# Altium schematic sheet POWER_OSC_BOOT.SchDoc
size A4; DrawnBy: Copyright © 2023 by; Engineer: Artyom Kislevitz Lee; Revision: A
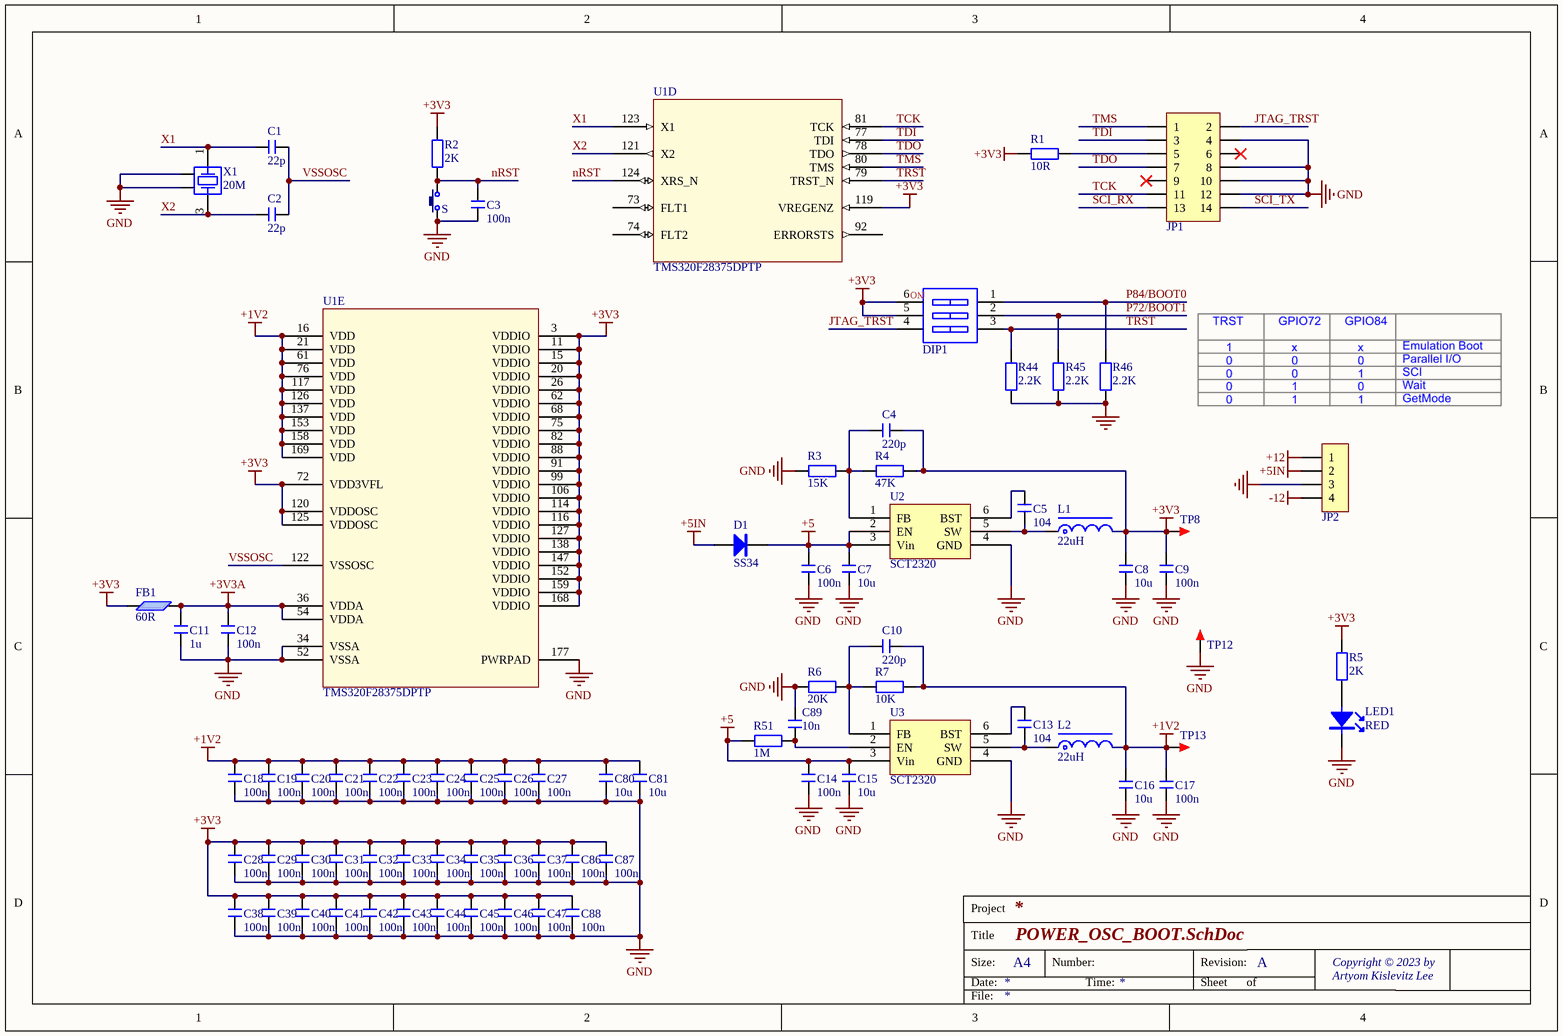
[diagram p0: POWER_OSC_BOOT.SchDoc]

## Parts
C1  22p  [C 0805_L]
C2  22p  [C 0805_L]
C3  100n  [C 0805_L]
C4  220p  [C 0805_L]
C5  104  [C 0805_L]
C6  100n  [C 0805_L]
C7  10u  [C 1210_L]
C8  10u  [C 1210_L]
C9  100n  [C 0805_L]
C10  220p  [C 0805_L]
C11  1u  [C 0805_L]
C12  100n  [C 0805_L]
C13  104  [C 0805_L]
C14  100n  [C 0805_L]
C15  10u  [C 1210_L]
C16  10u  [C 1210_L]
C17  100n  [C 0805_L]
C18  100n  [C 0603_L]
C19  100n  [C 0603_L]
C20  100n  [C 0603_L]
C21  100n  [C 0603_L]
C22  100n  [C 0603_L]
C23  100n  [C 0603_L]
C24  100n  [C 0603_L]
C25  100n  [C 0603_L]
C26  100n  [C 0603_L]
C27  100n  [C 0603_L]
C28  100n  [C 0603_L]
C29  100n  [C 0603_L]
C30  100n  [C 0603_L]
C31  100n  [C 0603_L]
C32  100n  [C 0603_L]
C33  100n  [C 0603_L]
C34  100n  [C 0603_L]
C35  100n  [C 0603_L]
C36  100n  [C 0603_L]
C37  100n  [C 0603_L]
C38  100n  [C 0603_L]
C39  100n  [C 0603_L]
C40  100n  [C 0603_L]
C41  100n  [C 0603_L]
C42  100n  [C 0603_L]
C43  100n  [C 0603_L]
C44  100n  [C 0603_L]
C45  100n  [C 0603_L]
C46  100n  [C 0603_L]
C47  100n  [C 0603_L]
C80  10u  [C 0805_L]
C81  10u  [C 0805_L]
C86  100n  [C 0603_L]
C87  100n  [C 0603_L]
C88  100n  [C 0603_L]
C89  10n  [C 0805_L]
D1  SS34  [SMA]
DIP1  SW-3P  [CSW1.27 SMD-3P]  (value not drawn)
FB1  60R  [R 0805_L]
JP1  Header 2X7  [IDC2.54-LI-2x7P]  (value not drawn)
JP2  HDR-1X4  [KF2510-LI-4P]  (value not drawn)
L1  22uH  [CDRH74]
L2  22uH  [CDRH74]
LED1  RED  [LED 0805R]
R1  10R  [R 0805_L]
R2  2K  [R 0805_L]
R3  15K  [R 0805_L]
R4  47K  [R 0805_L]
R5  2K  [R 0805_L]
R6  20K  [R 0805_L]
R7  10K  [R 0805_L]
R44  2.2K  [R 0805_L]
R45  2.2K  [R 0805_L]
R46  2.2K  [R 0805_L]
R51  1M  [R 0805_L]
S  3x6x5  [TSW DIP-3*6*4.3]  (value not drawn)
TP8  TEST  [TEST 1.6]  (value not drawn)
TP12  TEST  [TEST 1.6]  (value not drawn)
TP13  TEST  [TEST 1.6]  (value not drawn)
U1  TMS320F28375DPTP  [LQFP176-E 24x24_N]  (parts D,E of 5)
U2  SCT2320  [SOT23-6]
U3  SCT2320  [SOT23-6]
X1  20M  [OSC 3225-4P]

## Nets
+1V2: C10.2 C16.2 C17.2 C18.2 C19.2 C20.2 C21.2 C22.2 C23.2 C24.2 C25.2 C26.2 C27.2 C80.2 C81.2 L2.2 R7.2 TP13.1 U1.16(VDD) U1.21(VDD) U1.61(VDD) U1.76(VDD) U1.117(VDD) U1.126(VDD) U1.137(VDD) U1.153(VDD) U1.158(VDD) U1.169(VDD)
+3V3: C4.2 C8.2 C9.2 C28.2 C29.2 C30.2 C31.2 C32.2 C33.2 C34.2 C35.2 C36.2 C37.2 C38.2 C39.2 C40.2 C41.2 C42.2 C43.2 C44.2 C45.2 C46.2 C47.2 C86.2 C87.2 C88.2 DIP1.5 DIP1.6 FB1.1 L1.2 R1.2 R2.2 R4.2 R5.2 TP8.1 U1.3(VDDIO) U1.11(VDDIO) U1.15(VDDIO) U1.20(VDDIO) U1.26(VDDIO) U1.62(VDDIO) U1.68(VDDIO) U1.72(VDD3VFL) U1.75(VDDIO) U1.82(VDDIO) U1.88(VDDIO) U1.91(VDDIO) U1.99(VDDIO) U1.106(VDDIO) U1.114(VDDIO) U1.116(VDDIO) U1.119(VREGENZ) U1.120(VDDOSC) U1.125(VDDOSC) U1.127(VDDIO) U1.138(VDDIO) U1.147(VDDIO) U1.152(VDDIO) U1.159(VDDIO) U1.168(VDDIO)
+3V3A: C11.2 C12.2 FB1.2 U1.36(VDDA) U1.54(VDDA)
+5: C6.2 C7.2 C14.2 C15.2 D1.2(K) R51.1 U2.2(EN) U2.3(Vin) U3.3(Vin)
+5IN: D1.1(A) JP2.2
+12: JP2.1
-12: JP2.4
GND: C3.1 C6.1 C7.1 C8.1 C9.1 C11.1 C12.1 C14.1 C15.1 C16.1 C17.1 C18.1 C19.1 C20.1 C21.1 C22.1 C23.1 C24.1 C25.1 C26.1 C27.1 C28.1 C29.1 C30.1 C31.1 C32.1 C33.1 C34.1 C35.1 C36.1 C37.1 C38.1 C39.1 C40.1 C41.1 C42.1 C43.1 C44.1 C45.1 C46.1 C47.1 C80.1 C81.1 C86.1 C87.1 C88.1 C89.2 JP1.4 JP1.8 JP1.10 JP1.12 JP2.3 LED1.2(K) R3.1 R6.1 R44.2 R45.2 R46.2 S.1 TP12.1 U1.34(VSSA) U1.52(VSSA) U1.177(PWRPAD) U2.4(GND) U3.4(GND) X1.2 X1.4
JTAG_TRST: DIP1.4 JP1.2
nRST: C3.2 R2.1 S.2 U1.124(XRS_N)
P72/BOOT1: DIP1.2 R45.1
P84/BOOT0: DIP1.1 R46.1
SCI_RX: JP1.13
SCI_TX: JP1.14
TCK: JP1.11 U1.81(TCK)
TDI: JP1.3 U1.77(TDI)
TDO: JP1.7 U1.78(TDO)
TMS: JP1.1 U1.80(TMS)
TRST: DIP1.3 R44.1 U1.79(TRST_N)
VSSOSC: C1.1 C2.1 U1.122(VSSOSC)
X1: C1.2 U1.123(X1) X1.1
X2: C2.2 U1.121(X2) X1.3
NetC4_1: C4.1 R3.2 R4.1 U2.1(FB)
NetC5_1: C5.1 U2.6(BST)
NetC5_2: C5.2 L1.1 U2.5(SW)
NetC10_1: C10.1 R6.2 R7.1 U3.1(FB)
NetC13_1: C13.1 U3.6(BST)
NetC13_2: C13.2 L2.1 U3.5(SW)
NetC89_1: C89.1 R51.2 U3.2(EN)
NetJP1_5: JP1.5 R1.1
NetLED1_1: LED1.1(A) R5.1

Not connected (* = marked no-connect by the designer): JP1 6* 9*; U1 73(FLT1) 74(FLT2) 92(ERRORSTS)

## Notes on the sheet
- Project
- Title
- Size:
- Date:
- A4
- Number:
- Time:
- Revision:
- Sheet
- of
- Copyright © 2023 by
- Artyom Kislevitz Lee
- File:
- (in symbol SW-3P) NO

## Library data of the parts
C1-C47 C80 C81 C86-C89 = C: 贴片电容; 淘宝ID: 小糖豆的小窝窝; BOM名称: 贴片电容; 下单链接: https://item.taobao.com/item.htm?ft=t&id=613637044352
D1 = 1N4007: 整流二极管; 淘宝ID: 小糖豆的小窝窝; BOM名称: 整流二极管; 下单链接: https://item.taobao.com/item.htm?ft=t&id=613637044352
DIP1 = SW-3P: 3路编码开关; 淘宝ID: 小糖豆的小窝窝; BOM名称: 3路编码开关; 下单链接: https://item.taobao.com/item.htm?ft=t&id=613637044352
FB1 = FB: 磁珠; BOM名称: 贴片磁珠
JP1 = Header 7X2: 7*2P接插件; 淘宝ID: 小糖豆的小窝窝; BOM名称: 7*2P接插件; 下单链接: https://item.taobao.com/item.htm?ft=t&id=613637044352
JP2 = Header 4: 4P接插件; 淘宝ID: 小糖豆的小窝窝; BOM名称: 4P接插件; 下单链接: https://item.taobao.com/item.htm?ft=t&id=613637044352
L1 L2 = L-CDRH: 功率屏蔽电感; 淘宝ID: 小糖豆的小窝窝; BOM名称: 功率屏蔽电感; 下单链接: https://item.taobao.com/item.htm?ft=t&id=613637044352
LED1 = LED-SMD: 贴片LED; 淘宝ID: 小糖豆的小窝窝; BOM名称: 贴片LED; 下单链接: https://item.taobao.com/item.htm?ft=t&id=613637044352
R1-R7 R44-R46 R51 = R: 贴片电阻; 淘宝ID: 小糖豆的小窝窝; BOM名称: 贴片电阻; 下单链接: https://item.taobao.com/item.htm?ft=t&id=613637044352
S = TSW 3x6: 3x6轻触开关; 淘宝ID: 小糖豆的小窝窝; BOM名称: 3x6轻触开关; 下单链接: https://item.taobao.com/item.htm?ft=t&id=613637044352
TP8 TP12 TP13 = TEST: 测试点; 淘宝ID: 小糖豆的小窝窝; BOM名称: 测试点; 下单链接: https://item.taobao.com/item.htm?ft=t&id=613637044352
U1 = TMS320F28377DPTP: DSP 176; Manufacturer: Texas Instruments; CompType: IC; PIN_COUNT: 177; PartNumber: TMS320F28377DPTP; PackageReference: PTP0176F; MountType: SMT; RoHS: Y; RefDes: RefDes; Type: DEV; Value: Value
U2 U3 = SCT2330
X1 = XTAL-4P: 4脚无源晶振; 淘宝ID: 小糖豆的小窝窝; BOM名称: 4脚无源晶振; 下单链接: https://item.taobao.com/item.htm?ft=t&id=613637044352